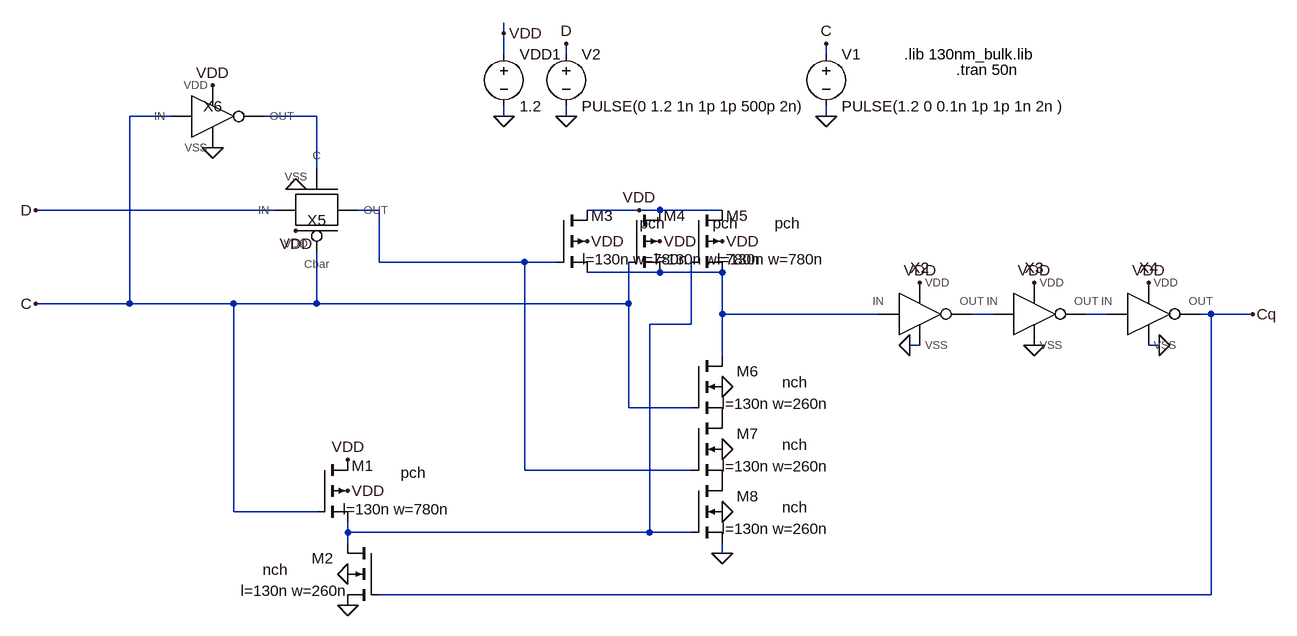
[diagram p0: schematic Prob7c.asc]
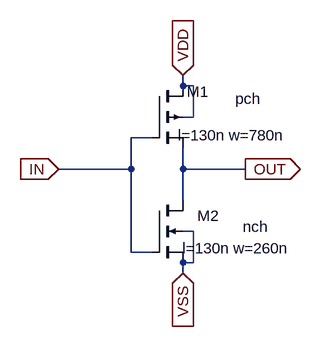
[diagram p1: sub-circuit inverter1.asc]
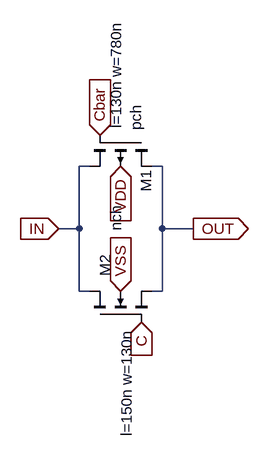
[diagram p2: sub-circuit tg.asc]
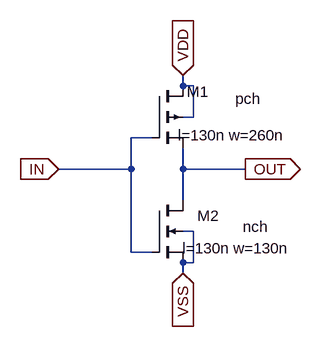
[diagram p3: sub-circuit inverter2.asc]
Prob7c.asc, the LTspice schematic file:
Version 4.1
SHEET 1 1376 680
WIRE 176 -320 176 -336
WIRE 176 -288 176 -320
WIRE 272 -288 272 -304
WIRE 672 -288 672 -304
WIRE -336 -192 -400 -192
WIRE -112 -192 -192 -192
WIRE 176 -192 176 -208
WIRE 272 -192 272 -208
WIRE 672 -192 672 -208
WIRE -112 -112 -112 -192
WIRE -176 -48 -544 -48
WIRE -16 -48 -48 -48
WIRE 384 -48 304 -48
WIRE 416 -48 384 -48
WIRE 512 -48 416 -48
WIRE -16 32 -16 -48
WIRE 208 32 -16 32
WIRE 256 32 208 32
WIRE 416 48 304 48
WIRE 512 48 416 48
WIRE -400 96 -400 -192
WIRE -400 96 -544 96
WIRE -240 96 -400 96
WIRE -112 96 -112 16
WIRE -112 96 -240 96
WIRE 368 96 368 32
WIRE 368 96 -112 96
WIRE 512 112 512 48
WIRE 752 112 512 112
WIRE 928 112 896 112
WIRE 1104 112 1072 112
WIRE 1264 112 1248 112
WIRE 1328 112 1264 112
WIRE 464 128 464 32
WIRE 464 128 400 128
WIRE 816 160 800 160
WIRE 1184 160 1168 160
WIRE 512 176 512 112
WIRE 368 256 368 96
WIRE 464 256 368 256
WIRE 208 352 208 32
WIRE 464 352 208 352
WIRE -240 416 -240 96
WIRE -112 416 -240 416
WIRE -64 448 -64 432
WIRE 400 448 400 128
WIRE 400 448 -64 448
WIRE 464 448 400 448
WIRE -64 464 -64 448
WIRE 512 480 512 464
WIRE 1264 544 1264 112
WIRE 1264 544 -16 544
FLAG -64 560 0
FLAG -64 512 0
FLAG 800 160 0
FLAG 992 160 0
FLAG 1184 160 0
FLAG -144 -80 0
FLAG -272 -144 0
FLAG 304 0 VDD
FLAG 416 0 VDD
FLAG 512 0 VDD
FLAG 816 64 VDD
FLAG 992 64 VDD
FLAG 1168 64 VDD
FLAG -144 -16 VDD
FLAG -64 336 VDD
FLAG -64 384 VDD
FLAG -272 -240 VDD
FLAG 384 -48 VDD
FLAG 512 224 0
FLAG 512 320 0
FLAG 512 416 0
FLAG 512 480 0
FLAG 672 -192 0
FLAG 672 -304 C
FLAG 272 -192 0
FLAG 272 -304 D
FLAG 176 -192 0
FLAG 176 -320 VDD
FLAG -544 -48 D
FLAG -544 96 C
FLAG 1328 112 Cq
SYMBOL Inverter1 816 112 R0
SYMATTR InstName X2
SYMBOL Inverter1 992 112 R0
SYMATTR InstName X3
SYMBOL Inverter1 1168 112 R0
SYMATTR InstName X4
SYMBOL pmos4 -112 336 R0
WINDOW 0 88 9 Right 2
WINDOW 3 168 20 Right 2
WINDOW 123 206 76 Right 2
SYMATTR InstName M1
SYMATTR Value pch
SYMATTR Value2 l=130n w=780n
SYMBOL nmos4 -16 464 M0
WINDOW 0 104 24 Right 2
WINDOW 3 179 41 Right 2
WINDOW 123 213 74 Right 2
SYMATTR InstName M2
SYMATTR Value nch
SYMATTR Value2 l=130n w=260n
SYMBOL TG -112 -48 M180
SYMATTR InstName X5
SYMBOL Inverter2 -272 -192 R0
SYMATTR InstName X6
SYMBOL pmos4 256 -48 R0
WINDOW 0 88 9 Right 2
WINDOW 3 168 20 Right 2
WINDOW 123 206 76 Right 2
SYMATTR InstName M3
SYMATTR Value pch
SYMATTR Value2 l=130n w=780n
SYMBOL pmos4 368 -48 R0
WINDOW 0 88 9 Right 2
WINDOW 3 168 20 Right 2
WINDOW 123 206 76 Right 2
SYMATTR InstName M4
SYMATTR Value pch
SYMATTR Value2 l=130n w=780n
SYMBOL pmos4 464 -48 R0
WINDOW 0 88 9 Right 2
WINDOW 3 168 20 Right 2
WINDOW 123 206 76 Right 2
SYMATTR InstName M5
SYMATTR Value pch
SYMATTR Value2 l=130n w=780n
SYMBOL nmos4 464 176 R0
WINDOW 0 104 24 Right 2
WINDOW 3 179 41 Right 2
WINDOW 123 213 74 Right 2
SYMATTR InstName M6
SYMATTR Value nch
SYMATTR Value2 l=130n w=260n
SYMBOL nmos4 464 272 R0
WINDOW 0 104 24 Right 2
WINDOW 3 179 41 Right 2
WINDOW 123 213 74 Right 2
SYMATTR InstName M7
SYMATTR Value nch
SYMATTR Value2 l=130n w=260n
SYMBOL nmos4 464 368 R0
WINDOW 0 104 24 Right 2
WINDOW 3 179 41 Right 2
WINDOW 123 213 74 Right 2
SYMATTR InstName M8
SYMATTR Value nch
SYMATTR Value2 l=130n w=260n
SYMBOL voltage 672 -304 R0
WINDOW 123 0 0 Left 0
WINDOW 39 0 0 Left 0
SYMATTR InstName V1
SYMATTR Value PULSE(1.2 0 0.1n 1p 1p 1n 2n )
SYMBOL voltage 272 -304 R0
WINDOW 123 0 0 Left 0
WINDOW 39 0 0 Left 0
SYMATTR InstName V2
SYMATTR Value PULSE(0 1.2 1n 1p 1p 500p 2n)
SYMBOL voltage 176 -304 R0
WINDOW 123 0 0 Left 2
WINDOW 39 0 0 Left 2
SYMATTR InstName VDD1
SYMATTR Value 1.2
TEXT 792 -288 Left 2 !.lib 130nm_bulk.lib
TEXT 872 -264 Left 2 !.tran 50n

inverter1.asc, the sub-circuit schematic file:
Version 4.1
SHEET 1 880 680
WIRE 176 32 176 16
WIRE 192 32 176 32
WIRE 192 80 192 32
WIRE 192 80 176 80
WIRE 128 112 96 112
WIRE 96 160 96 112
WIRE 96 160 -16 160
WIRE 176 160 176 128
WIRE 272 160 176 160
WIRE 176 208 176 160
WIRE 192 256 176 256
WIRE 96 288 96 160
WIRE 128 288 96 288
WIRE 192 304 192 256
WIRE 192 304 176 304
WIRE 176 320 176 304
FLAG -16 160 IN
IOPIN -16 160 In
FLAG 176 16 VDD
IOPIN 176 16 In
FLAG 176 320 VSS
IOPIN 176 320 In
FLAG 272 160 OUT
IOPIN 272 160 Out
SYMBOL pmos4 128 32 R0
WINDOW 0 88 9 Right 2
WINDOW 3 168 20 Right 2
WINDOW 123 206 76 Right 2
SYMATTR InstName M1
SYMATTR Value pch
SYMATTR Value2 l=130n w=780n
SYMBOL nmos4 128 208 R0
WINDOW 0 104 24 Right 2
WINDOW 3 179 41 Right 2
WINDOW 123 213 74 Right 2
SYMATTR InstName M2
SYMATTR Value nch
SYMATTR Value2 l=130n w=260n

tg.asc, the sub-circuit schematic file:
Version 4.1
SHEET 1 2188 680
WIRE 1920 -128 1904 -128
WIRE 2032 -128 2016 -128
WIRE 1904 -32 1904 -128
WIRE 1904 -32 1872 -32
WIRE 2032 -32 2032 -128
WIRE 2080 -32 2032 -32
WIRE 1904 64 1904 -32
WIRE 1920 64 1904 64
WIRE 2032 64 2032 -32
WIRE 2032 64 2016 64
FLAG 1936 -176 Cbar
IOPIN 1936 -176 In
FLAG 2000 112 C
IOPIN 2000 112 In
FLAG 1872 -32 IN
IOPIN 1872 -32 In
FLAG 2080 -32 OUT
IOPIN 2080 -32 Out
FLAG 1968 -128 VDD
IOPIN 1968 -128 In
FLAG 1968 64 VSS
IOPIN 1968 64 In
SYMBOL pmos4 2016 -176 R90
WINDOW 0 88 9 Right 2
WINDOW 3 -7 24 Right 2
WINDOW 123 -10 55 Right 2
SYMATTR InstName M1
SYMATTR Value pch
SYMATTR Value2 l=130n w=780n
SYMBOL nmos4 1920 112 R270
WINDOW 0 104 24 Right 2
WINDOW 3 179 41 Right 2
WINDOW 123 -10 57 Right 2
SYMATTR InstName M2
SYMATTR Value nch
SYMATTR Value2 l=150n w=130n

inverter2.asc, the sub-circuit schematic file:
Version 4.1
SHEET 1 880 680
WIRE 160 -64 160 -80
WIRE 176 -64 160 -64
WIRE 176 -16 176 -64
WIRE 176 -16 160 -16
WIRE 112 16 80 16
WIRE 80 64 80 16
WIRE 80 64 -32 64
WIRE 160 64 160 32
WIRE 256 64 160 64
WIRE 160 112 160 64
WIRE 176 160 160 160
WIRE 80 192 80 64
WIRE 112 192 80 192
WIRE 176 208 176 160
WIRE 176 208 160 208
WIRE 160 224 160 208
FLAG -32 64 IN
IOPIN -32 64 In
FLAG 160 -80 VDD
IOPIN 160 -80 In
FLAG 160 224 VSS
IOPIN 160 224 In
FLAG 256 64 OUT
IOPIN 256 64 Out
SYMBOL pmos4 112 -64 R0
WINDOW 0 88 9 Right 2
WINDOW 3 168 20 Right 2
WINDOW 123 206 76 Right 2
SYMATTR InstName M1
SYMATTR Value pch
SYMATTR Value2 l=130n w=260n
SYMBOL nmos4 112 112 R0
WINDOW 0 104 24 Right 2
WINDOW 3 179 41 Right 2
WINDOW 123 213 74 Right 2
SYMATTR InstName M2
SYMATTR Value nch
SYMATTR Value2 l=130n w=130n

The netlist it stands for:
* Prob7c.asc
X§X2 N003 VDD 0 N004 inverter1
X§X3 N004 VDD 0 N005 inverter1
X§X4 N005 VDD 0 Cq inverter1
M1 VDD C N006 VDD pch l=130n w=780n
M2 N006 Cq 0 0 nch l=130n w=260n
X§X5 N001 C D VDD 0 N002 tg
X§X6 C VDD 0 N001 inverter2
M3 VDD N002 N003 VDD pch l=130n w=780n
M4 VDD C N003 VDD pch l=130n w=780n
M5 VDD N006 N003 VDD pch l=130n w=780n
M6 N003 C P001 0 nch l=130n w=260n
M7 P001 N002 P002 0 nch l=130n w=260n
M8 P002 N006 0 0 nch l=130n w=260n
V1 C 0 PULSE(1.2 0 0.1n 1p 1p 1n 2n )
V2 D 0 PULSE(0 1.2 1n 1p 1p 500p 2n)
VDD1 VDD 0 1.2

* block symbol definitions
.subckt inverter1 IN VDD VSS OUT
M1 VDD IN OUT VDD pch l=130n w=780n
M2 OUT IN VSS VSS nch l=130n w=260n
.ends inverter1

.subckt tg C Cbar IN VDD VSS OUT
M1 OUT Cbar IN VDD pch l=130n w=780n
M2 IN C OUT VSS nch l=150n w=130n
.ends tg

.subckt inverter2 IN VDD VSS OUT
M1 VDD IN OUT VDD pch l=130n w=260n
M2 OUT IN VSS VSS nch l=130n w=130n
.ends inverter2

.model NMOS NMOS
.model PMOS PMOS
.lib standard.mos
.lib 130nm_bulk.lib
.tran 50n
.backanno
.end